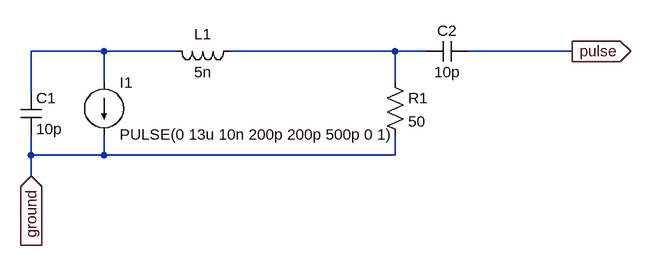
[diagram p0: schematic pulse-generator.gerard.asc]
pulse-generator.gerard.asc, the LTspice schematic file:
Version 4
SHEET 1 880 680
WIRE -80 208 -192 208
WIRE 32 208 -80 208
WIRE 368 208 112 208
WIRE 416 208 368 208
WIRE 640 208 480 208
WIRE -80 256 -80 208
WIRE 368 256 368 208
WIRE -192 272 -192 208
WIRE -192 368 -192 336
WIRE -80 368 -80 336
WIRE -80 368 -192 368
WIRE 368 368 368 336
WIRE 368 368 -80 368
WIRE -192 400 -192 368
FLAG -192 400 ground
IOPIN -192 400 In
FLAG 640 208 pulse
IOPIN 640 208 Out
SYMBOL ind 128 192 R90
WINDOW 0 5 56 VBottom 2
WINDOW 3 32 56 VTop 2
SYMATTR InstName L1
SYMATTR Value 5n
SYMBOL cap -208 272 R0
SYMATTR InstName C1
SYMATTR Value 10p
SYMBOL res 352 240 R0
SYMATTR InstName R1
SYMATTR Value 50
SYMBOL current -80 256 R0
WINDOW 123 0 0 Left 2
WINDOW 39 0 0 Left 2
SYMATTR InstName I1
SYMATTR Value PULSE(0 13u 10n 200p 200p 500p 0 1)
SYMBOL cap 480 192 R90
WINDOW 0 0 32 VBottom 2
WINDOW 3 32 32 VTop 2
SYMATTR InstName C2
SYMATTR Value 10p

The netlist it stands for:
* pulse-generator.gerard.asc
L1 N002 N001 5n
C1 N001 ground 10p
R1 N002 ground 50
I1 N001 ground PULSE(0 13u 10n 200p 200p 500p 0 1)
C2 pulse N002 10p
.backanno
.end